# EAGLE design PRECISION_CLOCK (1) (EAGLE 9.6.2)
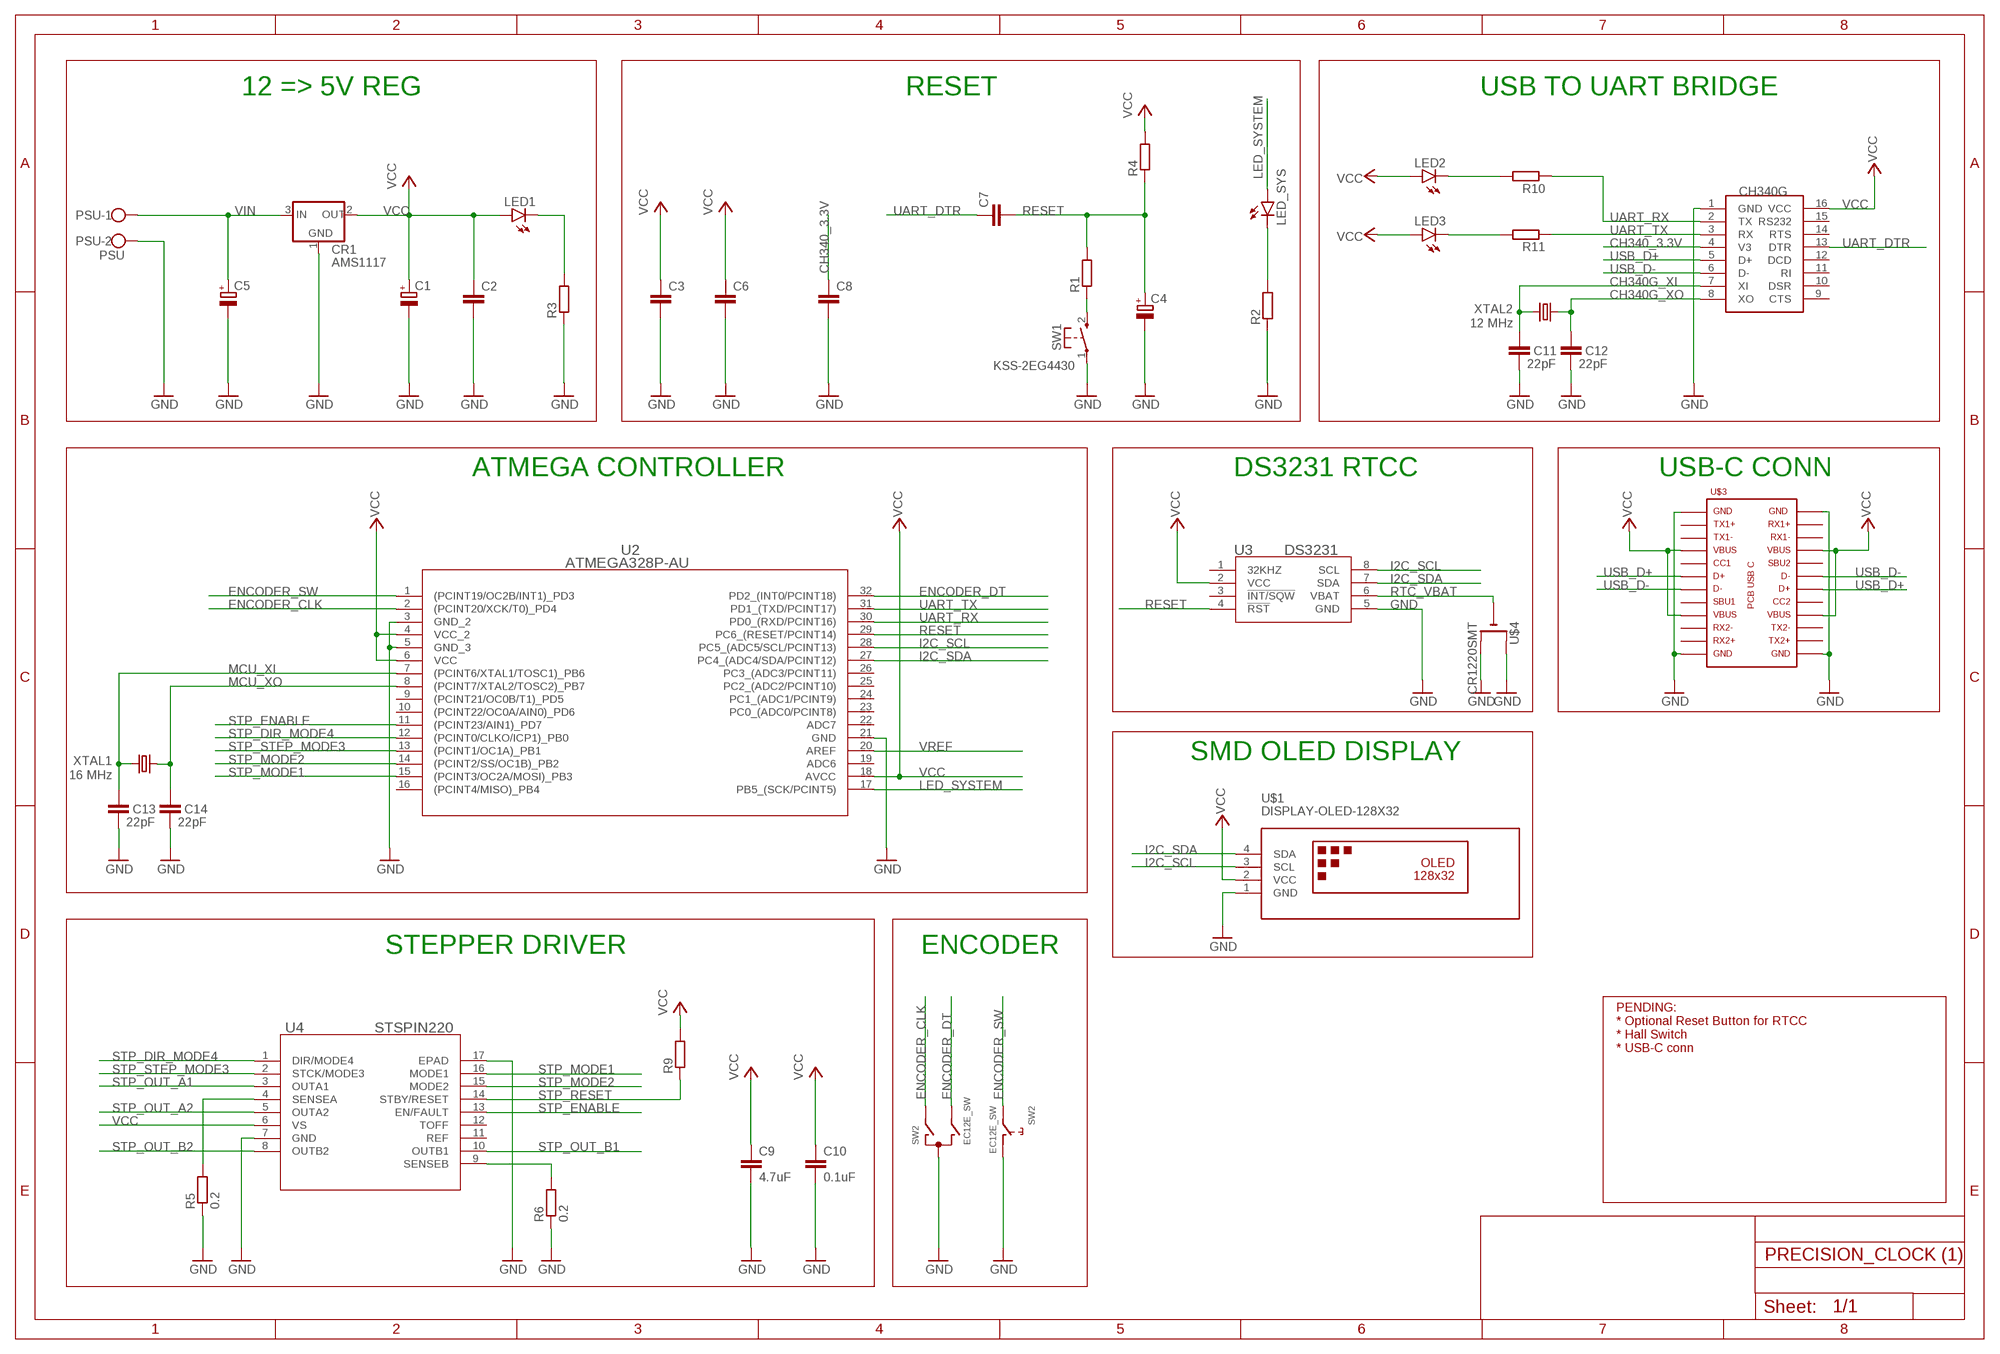
[diagram p0: schematic, sheet 1]

## Parts
C1  CPOL-EU153CLV-0505  [153CLV-0505]
C2  C-EUC0805  [C0805]
C3  C-EUC0805  [C0805]
C4  CPOL-EU153CLV-0505  [153CLV-0505]
C5  CPOL-EU153CLV-0505  [153CLV-0505]
C6  C-EUC0805  [C0805]
C7  C-EUC0805  [C0805]
C8  C-EUC0805  [C0805]
C9  4.7uF  C-EUC0805  [C0805]
C10  0.1uF  C-EUC0805  [C0805]
C11  22pF  C-EUC0805  [C0805]
C12  22pF  C-EUC0805  [C0805]
C13  22pF  C-EUC0805  [C0805]
C14  22pF  C-EUC0805  [C0805]
CR1  AMS1117  [SOT223]
LED1  LEDSML0805  [SML0805]
LED2  LEDSML0805  [SML0805]
LED3  LEDSML0805  [SML0805]
LED_SYS  LEDSML0805  [SML0805]
PSU  PSU  W237-102  [W237-102]
R1  R-EU_R0805  [R0805]
R2  R-EU_R0805  [R0805]
R3  R-EU_R0805  [R0805]
R4  R-EU_R0805  [R0805]
R5  0.2  R-EU_R0805  [R0805]
R6  0.2  R-EU_R0805  [R0805]
R9  R-EU_R0805  [R0805]
R10  R-EU_R0805  [R0805]
R11  R-EU_R0805  [R0805]
SW1  KSS-2EG4430  [KSS-2EG4430]
SW2  EC12E_SW  [ALPS_EC12E_SW]
U2  ATMEGA328P-AU  [32A_ATM]
U3  DS3231  [21-0041B_8_MXM]
U4  STSPIN220  [VFQFPN-16_STM]
U$1  DISPLAY-OLED-128X32  [DISPLAY-OLED-128X32]
U$2  CH340G  [SOIC16]
U$3  PCB_USB_CDS_2  [USB_TYPE_C_DS_2]
U$4  CR1220SMT  [CR1220-SMD]
XTAL1  16 MHz  CRYSTALSM49  [SM49]
XTAL2  12 MHz  CRYSTALSM49  [SM49]

## Nets
CH340_3.3V: C8.1 U$2.4(V3)
CH340G_XI: C11.1 U$2.7(XI) XTAL2.2
CH340G_XO: C12.1 U$2.8(XO) XTAL2.1
ENCODER_CLK: SW2.A U2.2((PCINT20/XCK/T0)_PD4)
ENCODER_DT: SW2.B U2.32(PD2_(INT0/PCINT18))
ENCODER_SW: SW2.E U2.1((PCINT19/OC2B/INT1)_PD3)
GND: C1.- C2.2 C3.2 C4.- C5.- C6.2 C8.2 C9.2 C10.2 C11.2 C12.2 C13.2 C14.2 CR1.1(GROUND) PSU.2 R2.1 R3.1 R5.1 R6.1 SW1.1(P) SW2.C SW2.D U2.3(GND_2) U2.5(GND_3) U2.21(GND) U3.5(GND) U4.7(GND) U4.17(EPAD) U$1.1(GND) U$2.1(GND) U$3.A1 U$3.A12 U$3.B1 U$3.B12 U$4.+$1(+) U$4.+$2(+1)
I2C_SCL: U2.28(PC5_(ADC5/SCL/PCINT13)) U3.8(SCL) U$1.3(SCL)
I2C_SDA: U2.27(PC4_(ADC4/SDA/PCINT12)) U3.7(SDA) U$1.4(SDA)
LED_SYSTEM: LED_SYS.A U2.17(PB5_(SCK/PCINT5))
MCU_XI: C13.1 U2.7((PCINT6/XTAL1/TOSC1)_PB6) XTAL1.2
MCU_XO: C14.1 U2.8((PCINT7/XTAL2/TOSC2)_PB7) XTAL1.1
N$1: LED_SYS.C R2.2
N$2: R5.2 U4.4(SENSEA)
N$3: LED1.C R3.2
N$4: R1.1 SW1.2(S)
N$5: R6.2 U4.9(SENSEB)
N$10: LED2.C R10.2
N$11: LED3.C R11.2
RESET: C4.+ C7.2 R1.2 R4.1 U2.29(PC6_(RESET/PCINT14)) U3.4(!RST)
RTC_VBAT: U3.6(VBAT) U$4.-
STP_DIR_MODE4: U2.12((PCINT0/CLKO/ICP1)_PB0) U4.1(DIR/MODE4)
STP_ENABLE: U2.11((PCINT23/AIN1)_PD7) U4.13(EN/FAULT)
STP_MODE1: U2.15((PCINT3/OC2A/MOSI)_PB3) U4.16(MODE1)
STP_MODE2: U2.14((PCINT2/SS/OC1B)_PB2) U4.15(MODE2)
STP_OUT_A1: U4.3(OUTA1)
STP_OUT_A2: U4.5(OUTA2)
STP_OUT_B1: U4.10(OUTB1)
STP_OUT_B2: U4.8(OUTB2)
STP_RESET: R9.1 U4.14(STBY/RESET)
STP_STEP_MODE3: U2.13((PCINT1/OC1A)_PB1) U4.2(STCK/MODE3)
UART_DTR: C7.1 U$2.13(DTR)
UART_RX: R10.1 U2.30(PD0_(RXD/PCINT16)) U$2.2(TX)
UART_TX: R11.1 U2.31(PD1_(TXD/PCINT17)) U$2.3(RX)
USB_D+: U$2.5(D+) U$3.A6 U$3.B6
USB_D-: U$2.6(D-) U$3.A7 U$3.B7
VCC: C1.+ C2.1 C3.1 C6.1 C9.1 C10.1 CR1.2(OUT) LED1.A LED2.A LED3.A R4.2 R9.2 U2.4(VCC_2) U2.6(VCC) U2.18(AVCC) U3.2(VCC) U4.6(VS) U$1.2(VCC) U$2.16(VCC) U$3.A4 U$3.A9 U$3.B4 U$3.B9
VIN: C5.+ CR1.3(IN) PSU.1
VREF: U2.20(AREF)
Unconnected: SW2.GND1(G) SW2.GND2(G) U2.9((PCINT21/OC0B/T1)_PD5) U2.10((PCINT22/OC0A/AIN0)_PD6) U2.16((PCINT4/MISO)_PB4) U2.19(ADC6) U2.22(ADC7) U2.23(PC0_(ADC0/PCINT8)) U2.24(PC1_(ADC1/PCINT9)) U2.25(PC2_(ADC2/PCINT10)) U2.26(PC3_(ADC3/PCINT11)) U3.1(32KHZ) U3.3(!INT/SQW) U4.11(REF) U4.12(TOFF) U$2.9(CTS) U$2.10(DSR) U$2.11(RI) U$2.12(DCD) U$2.14(RTS) U$2.15(RS232) U$3.A2 U$3.A3 U$3.A5 U$3.A8 U$3.A10 U$3.A11 U$3.B2 U$3.B3 U$3.B5 U$3.B8 U$3.B10 U$3.B11

## Notes on the sheet
- 12 => 5V REG | RESET | USB TO UART BRIDGE
- ATMEGA CONTROLLER | DS3231 RTCC | USB-C CONN
- SMD OLED DISPLAY
- STEPPER DRIVER | ENCODER
- PENDING:
  * Optional Reset Button for RTCC
  * Hall Switch
  * USB-C conn

## Library data of the parts
C1 C4 C5 = resistor:CPOL-EU: POLARIZED CAPACITOR, European symbol
C2 C3 C6-C14 = resistor:C-EU: CAPACITOR, European symbol
CR1 = AMS1117:AMS1117
LED1-LED3 LED_SYS = led:LED: LED OSRAM: - CHIPLED LG R971, LG N971, LY N971, LG Q971, LY Q971, LO R971, LY R971 LH N974, LH R974 LS Q976, LO Q976, LY Q976 LO Q996 - Hyper CHIPLED LW Q18S LB Q993, LB Q99A, LB R99A - SideLED LS A670, LO A670, LY A670, LG A670, LP A670 LB A673, LV A673, LT A673, LW A673 LH A674 LY A675 LS A676, LA A676, LO A676, LY A676, LW A676 LS A679, LY A679, LG A679 - Hyper Micro SIDELED® LS Y876, LA Y876, LO Y876, LY Y876 LT Y87S - SmartLED LW L88C, LW L88S LB L89C, LB L89S, LG L890 LS L89K, LO L89K, LY L89K LS L896, LA L896, LO L896, LY L896 - TOPLED LS T670, LO T670, LY T670, LG T670, LP T670 LSG T670, LSP T670, LSY T670, LOP T670, LYG T670 LG T671, LOG T671, LSG T671 LB T673, LV T673, LT T673, LW T673 LH T674 LS T676, LA T676, LO T676, LY T676, LB T676, LH T676, LSB T676, LW T676 LB T67C, LV T67C, LT T67C, LS T67K, LO T67K, LY T67K, LW E67C LS E67B, LA E67B, LO E67B, LY E67B, LB E67C, LV E67C, LT E67C LW T67C LS T679, LY T679, LG T679 LS T770, LO T770, LY T770, LG T770, LP T770 LB T773, LV T773, LT T773, LW T773 LH T774 LS E675, LA E675, LY E675, LS T675 LS T776, LA T776, LO T776, LY T776, LB T776 LHGB T686 LT T68C, LB T68C - Hyper Mini TOPLED® LB M676 - Mini TOPLED Santana® LG M470 LS M47K, LO M47K, LY M47K Source: http://www.osram.convergy.de LUXEON: - LUMILED® LXK2-PW12-R00, LXK2-PW12-S00, LXK2-PW14-U00, LXK2-PW14-V00 LXK2-PM12-R00, LXK2-PM12-S00, LXK2-PM14-U00 LXK2-PE12-Q00, LXK2-PE12-R00, LXK2-PE12-S00, LXK2-PE14-T00, LXK2-PE14-U00 LXK2-PB12-K00, LXK2-PB12-L00, LXK2-PB12-M00, LXK2-PB14-N00, LXK2-PB14-P00, LXK2-PB14-Q00 LXK2-PR12-L00, LXK2-PR12-M00, LXK2-PR14-Q00, LXK2-PR14-R00 LXK2-PD12-Q00, LXK2-PD12-R00, LXK2-PD12-S00 LXK2-PH12-R00, LXK2-PH12-S00 LXK2-PL12-P00, LXK2-PL12-Q00, LXK2-PL12-R00 Source: www.luxeon.com KINGBRIGHT: KA-3528ASYC Source: www.kingbright.com
PSU = con-wago-500:W237-102: WAGO SCREW CLAMP; MPN: 237-102; OC_FARNELL: unknown; OC_NEWARK: 70K9898
R1-R6 R9-R11 = resistor:R-EU_: RESISTOR, European symbol
SW1 = buttons:KSS-2EG4430: Size: 3x6mm Height: 5mm from PCB Rating: DC12v 50mA Travel: 0.25±0.10mm Operating Force: 180±50gf Return Force: 60gf min Contact resistance: 100m? max Insulation resistance: 100M? min Operating life?50,000 cycles
SW2 = switch-alps:EC12E_SW: ALPS rotary Encoder EC12E series with switch; MPN: EC12E2424407; OC_FARNELL: 1520813; OC_NEWARK: 74M1068
U2 = Atmega328P:ATMEGA328P-AU; BUILT_BY: EMA_UL_Team; MANUFACTURER_PART_NUMBER: ATMEGA328P-AU; SOURCELIBRARY: Atmel_2011-04-02; VENDOR: Atmel
U3 = DS3231:DS3231; BUILT_BY: EMA_UL_Team; MANUFACTURER_PART_NUMBER: DS3231MZ/V+T; REVISION: 3; SOURCELIBRARY: Maxim_2014-04-30_1; VENDOR: Maxim Integrated Products
U4 = STSPIN220:STSPIN220; BUILT_BY: EMA_Jessica; COPYRIGHT: Copyright (C) 2018 Accelerated Designs. All rights reserved; MANUFACTURER_PART_NUMBER: STSPIN220; SOURCELIBRARY: Update_to_database_2020-12-04; VENDOR: STMicroelectronics
U$1 = diy-modules:DISPLAY-OLED-128X32: 128x32 Dot Matrix OLED Module with I2C interface based on SSD1306 chip More details available here: http://www.tinyosshop.com/index.php?route=product/product&product_id=953 Schematic available here: http://www.tinyosshop.com/datasheet/OLED%2012832.pdf SSD1306 datasheet: https://cdn-shop.adafruit.com/datasheets/SSD1306.pdf Click here to find device on ebay.com <http://www.ebay.com/sch/oled+display+128x32+i2c>
U$2 = ch340g:CH340G
U$3 = USB_pcb_connectors:PCB_USB_C
U$4 = CR1220:CR1220: CR1216/CR1220/CR1225 12mm 3V lithium coin cell Great for battery packup. Both SMT and THM holders. Note the THM package has the ground pads on both sides of the PCB so that the masks are the same - this reduces the cost Check prices <https://pricing.snapeda.com/parts/CR1220/FDK%20America%2C%20Inc.%2C%20a%20member%20of%20Fujitsu%20Group/view-part?ref=eda>; AVAILABILITY: In Stock; DESCRIPTION: Coin, 12.5mm Lithium Manganese Dioxide 3V Battery Non-Rechargeable (Primary); MF: FDK America, Inc., a member of Fujitsu Group; MP: CR1220; PACKAGE: FDK America, Inc., a member of Fujitsu Group; PRICE: None
XTAL1 XTAL2 = crystal:CRYSTAL: CRYSTAL; OC_FARNELL: unknown; OC_NEWARK: unknown

## Board
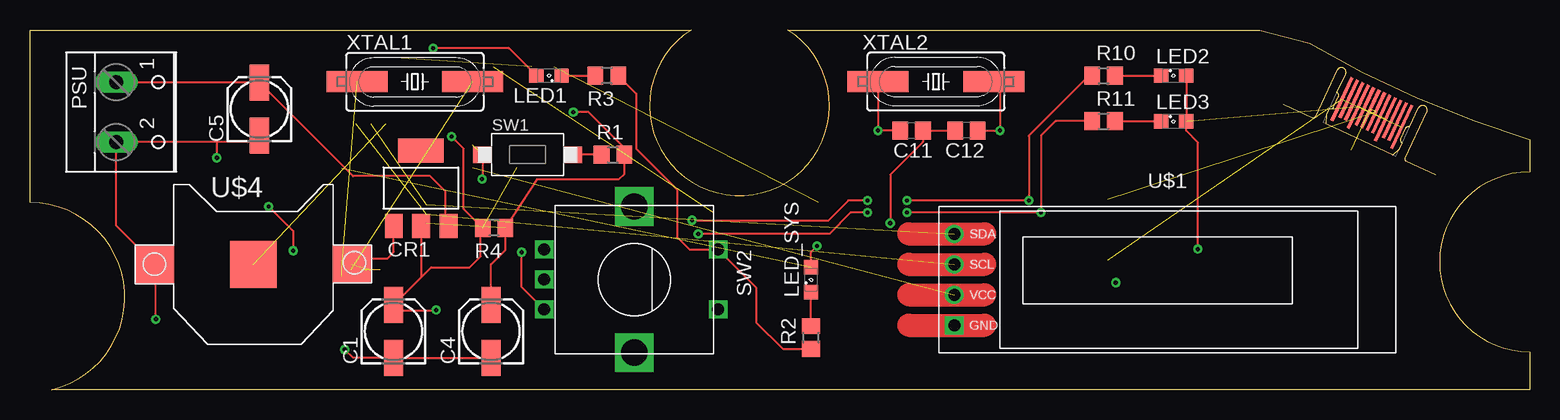
[diagram p1: board, top side]
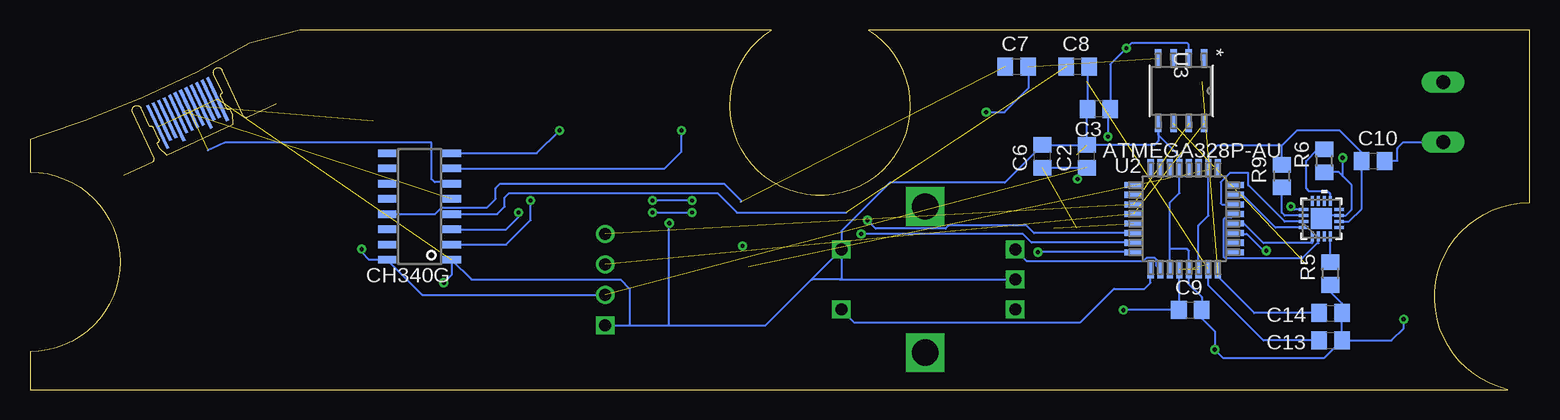
[diagram p2: board, bottom side, seen from below]

Size 125 x 30 mm. Coordinates in mm from the lower left corner, seen from the top.
Outline: 125,0 1.8,0 arc167 0,15.6 0,30 55.1,30 arc295 63.18,30 102.52,30 106.67,28.89 arc13 125,20.85 125,18.15 arc180 125,3.15 125,0
Copper layers (1*16): Top 0.035mm / dielectric 1.5mm / Bottom 0.035mm
Design rules "default": minimum track width 6mil, minimum drill 0.35mm, track to track 6mil, track to pad 6mil, pad to pad 6mil, via to via 6mil, smd to smd 6mil, copper to edge 40mil, drill to drill 6mil, minimum pad ring 10mil, minimum via ring 8mil, stop-mask expansion 4mil, vias tented up to drill 0mil, thermal gap 10mil

### Footprints (pad centres in the part's own frame; a part is rotated, then mirrored left to right if it is on the bottom)
153CLV-0505 = smd 3 x 1.6: + 2.2,0; - -2.2,0
C0805 = smd 1.3 x 1.5: 1 -0.95,0; 2 0.95,0
SOT223 = smd 1.499 x 2.007: 1 -2.261,-3.15; 2 0.025,-3.15; 3 2.311,-3.15 | smd 3.81 x 2.007: 4 0,3.15
SML0805 = smd 1.2 x 1.2: A 1.05,0; C -1.05,0
W237-102 = drill 1.194 long: 1 -2.5,-1.27; 2 2.5,-1.27
R0805 = smd 1.3 x 1.5: 1 -0.95,0; 2 0.95,0
KSS-2EG4430 = smd 1.6 x 1.4: 1 -3.75,0; 2 3.75,0
ALPS_EC12E_SW = drill 1 square: A -2.5,-7.5; B 2.5,-7.5; C 0,-7.5; D -2.5,7; E 2.5,7 | drill 2.2 square: GND1 -6.1,0; GND2 6.1,0
32A_ATM = smd 1.473 x 0.508: 1 -4.242,2.8; 2 -4.242,2; 3 -4.242,1.2; 4 -4.242,0.4; 5 -4.242,-0.4; 6 -4.242,-1.2; 7 -4.242,-2; 8 -4.242,-2.8; 17 4.242,-2.8; 18 4.242,-2; 19 4.242,-1.2; 20 4.242,-0.4; 21 4.242,0.4; 22 4.242,1.2; 23 4.242,2; 24 4.242,2.8 | smd 0.508 x 1.473: 9 -2.8,-4.242; 10 -2,-4.242; 11 -1.2,-4.242; 12 -0.4,-4.242; 13 0.4,-4.242; 14 1.2,-4.242; 15 2,-4.242; 16 2.8,-4.242; 25 2.8,4.242; 26 2,4.242; 27 1.2,4.242; 28 0.4,4.242; 29 -0.4,4.242; 30 -1.2,4.242; 31 -2,4.242; 32 -2.8,4.242
21-0041B_8_MXM = smd 1.46 x 0.533: 1 -2.724,1.905; 2 -2.724,0.635; 3 -2.724,-0.635; 4 -2.724,-1.905; 5 2.724,-1.905; 6 2.724,-0.635; 7 2.724,0.635; 8 2.724,1.905
VFQFPN-16_STM = smd 0.813 x 0.254: 1 -1.473,0.75; 2 -1.473,0.25; 3 -1.473,-0.25; 4 -1.473,-0.75; 9 1.473,-0.75; 10 1.473,-0.25; 11 1.473,0.25; 12 1.473,0.75 | smd 0.254 x 0.813: 5 -0.75,-1.473; 6 -0.25,-1.473; 7 0.25,-1.473; 8 0.75,-1.473; 13 0.75,1.473; 14 0.25,1.473; 15 -0.25,1.473; 16 -0.75,1.473 | smd 1.753 x 1.753: 17 0,0
DISPLAY-OLED-128X32 = drill 1 square: 1 -17.78,-3.81 | drill 1: 2 -17.78,-1.27; 3 -17.78,1.27; 4 -17.78,3.81
SOIC16 = smd 0.635 x 1.524: 1 -4.445,-2.695; 2 -3.175,-2.695; 3 -1.905,-2.695; 4 -0.635,-2.695; 5 0.635,-2.695; 6 1.905,-2.695; 7 3.175,-2.695; 8 4.445,-2.695; 9 4.445,2.695; 10 3.175,2.695; 11 1.905,2.695; 12 0.635,2.695; 13 -0.635,2.695; 14 -1.905,2.695; 15 -3.175,2.695; 16 -4.445,2.695
USB_TYPE_C_DS_2 = smd 0.25 x 4: A1 2.75,-2.45; A4 1.25,-2.45; A9 -1.25,-2.45; A12 -2.75,-2.45 | smd 0.25 x 3.5: A2 2.25,-2.7; A3 1.75,-2.7; A5 0.75,-2.7; A6 0.25,-2.7; A7 -0.25,-2.7; A8 -0.75,-2.7; A10 -1.75,-2.7; A11 -2.25,-2.7 | smd 0.25 x 4 bottom: B1 -2.75,-2.45; B4 -1.25,-2.45; B9 1.25,-2.45; B12 2.75,-2.45 | smd 0.25 x 3.5 bottom: B2 -2.25,-2.7; B3 -1.75,-2.7; B5 -0.75,-2.7; B6 -0.25,-2.7; B7 0.25,-2.7; B8 0.75,-2.7; B10 1.75,-2.7; B11 2.25,-2.7
CR1220-SMD = smd 3.2 x 3.2: +$1 -8.2,0; +$2 8.2,0 | smd 3.9 x 3.9: - 0,0
SM49 = smd 5.08 x 1.778: 1 -4.826,0; 2 4.826,0

### Placement (x,y rotation side)
C1  30.31,4.85 90 top
C2  36.91,19.46 90 bottom
C3  35.9,23.4 180 bottom
C4  38.44,4.85 90 top
C5  19.13,23.4 90 top
C6  40.59,19.46 90 bottom
C7  42.75,26.95 0 bottom
C8  37.67,26.95 0 bottom
C9  28.28,6.63 0 bottom
C10  13.04,19.08 0 bottom
C11  73.49,21.62 0 top
C12  78.06,21.62 180 top
C13  16.59,4.09 0 bottom
C14  16.59,6.38 0 bottom
CR1  32.59,16.79 0 top
LED1  43.26,26.19 180 top
LED2  95.33,26.19 0 top
LED3  95.33,22.38 0 top
LED_SYS  65.11,9.17 90 top
PSU  8.46,23.14 270 top
R1  48.6,19.59 0 top
R2  65.11,4.35 90 top
R3  48.09,26.19 180 top
R4  38.69,13.49 180 top
R5  16.59,9.68 90 bottom
R6  17.1,19.08 90 bottom
R9  20.66,17.81 90 bottom
R10  89.49,26.19 0 top
R11  89.49,22.38 0 top
SW1  41.48,19.59 0 top
SW2  50.37,9.17 270 top
U2  28.78,14.25 90 bottom
U3  29.04,24.92 270 bottom
U4  17.35,14.25 90 bottom
U$1  94.82,9.17 0 top
U$2  92.54,15.27 90 bottom
U$3  110.83,20.86 155 top
U$4  18.62,10.44 0 top
XTAL1  32.09,25.68 0 top
XTAL2  75.52,25.68 180 top

### Tracks (layer width: path | path; a pad name or v marks a point on that pad's centre or on a via)
CH340_3.3V  (1 unrouted)
  Bottom 0.152: U$2.4 86.06,14.63 85.43,15.27 85.43,16.03 85.07,16.38 67.7,16.38 66.07,14.76 56.98,14.76
CH340G_XI  (via drill 0.35)
  Top 0.152: XTAL2.2 v70.69,21.62 C11.1
  Bottom 0.152: U$2.7 72.09,18.44 70.69,19.84 v70.69,21.62
CH340G_XO  (via drill 0.35)
  Top 0.152: XTAL2.1 80.85,25.17 v80.85,21.62 C12.1
  Bottom 0.152: U$2.8 82.76,19.71 v80.85,21.62
ENCODER_CLK
  Bottom 0.152: U2.2 31.1,10.33 31.1,10.84 31.23,10.98 31.93,10.98 32.21,10.7 41.9,10.7 SW2.A
ENCODER_DT  (via drill 0.35)
  Top 0.152: SW2.B 40.98,8.57 v40.98,11.46
  Bottom 0.152: U2.32 v40.98,11.46
ENCODER_SW
  Bottom 0.152: SW2.E 56.32,5.62 37.42,5.62 34.63,8.41 32.09,8.41 31.58,8.91 U2.1
GND  (via drill 0.35)  (6 unrouted)
  Top 0.152: U$4.+$2 27.33,10.95 29.8,10.95 30.33,11.48 CR1.1 | C4.- C1.- 26.92,2.65 v26.24,3.33 | C5.- 18.58,20.64 15.58,20.64 | 15.58,20.64 PSU.2 7.19,13.67 U$4.+$1 10.42,5.94 v10.5,5.87 | R3.1 50.53,24.69 50.53,20.09 53.93,16.7 53.93,12.73 54.99,11.67 SW2.D 60.53,8.51 60.53,5.62 62.75,3.4 R2.1 | 37.17,19.02 SW1.1 37.73,17.61 v37.67,17.55 | 15.58,20.64 v15.58,19.33 | C12.2 C11.2 74.44,20.66 71.71,17.94 v71.71,13.87
  Bottom 0.152: 29.98,11.71 U2.3 30.05,9.94 | 29.98,11.71 29.98,15.59 29.18,16.39 U2.21 29.18,19.48 30.94,21.24 U3.5 30.94,20.73 31.26,20.41 C2.2 | C10.2 12.05,19.11 12.02,19.08 11,19.08 11,20.09 11.04,20.13 10.52,20.64 PSU.2 | 15.52,14.5 U4.7 | U4.7 15.33,14.5 14.81,15.01 14.81,17.05 15.58,17.81 | 15.58,17.81 15.9,18.13 R6.1 | C2.2 36.91,23.33 C3.2 36.85,26.83 C8.2 | C2.2 C6.2 43.74,17.27 53.33,17.27 57.37,13.22 SW2.D | C13.2 15.58,4.09 | 29.98,11.71 28.53,11.71 28.38,11.57 U2.5 28.38,8.77 27.33,7.71 C9.2 27.33,5.94 26.24,4.85 v26.24,3.33 25.52,2.61 17.13,2.61 C13.2 | 57.49,9.17 SW2.C | U$1.1 75.01,5.36 | 75.01,5.36 71.71,5.36 | 71.71,5.36 63.68,5.36 59.82,9.22 | 59.82,9.22 SW2.D | 75.01,5.36 75.01,8.41 75.77,9.17 88.19,9.17 U$2.1 89.84,9.58 v90.51,8.92 | 15.58,17.81 v15.58,19.33 | 57.49,9.17 59.77,9.17 59.82,9.22 | SW2.D 57.37,9.28 57.49,9.17 | C13.2 C14.2 15.64,7.21 16.59,8.16 R5.1 | U4.7 17.1,14.5 U4.17 | C13.2 11.51,4.09 10.5,5.11 v10.5,5.87 | 71.71,5.36 v71.71,13.87
I2C_SCL  (2 unrouted)
I2C_SDA  (2 unrouted)
LED_SYSTEM  (via drill 0.35)  (1 unrouted)
  Top 0.152: LED_SYS.A 65.11,11.46 v65.61,11.97
MCU_XI  (1 unrouted)
  Bottom 0.152: C13.1 22.18,4.09 26.78,8.7 U2.7
MCU_XO  (2 unrouted)
  Bottom 0.152: C14.1 22.94,6.38 25.99,9.43
N$1
  Top 0.152: R2.2 LED_SYS.C
N$2
  Bottom 0.152: R5.2 16.59,12.77 U4.4
N$3
  Top 0.152: LED1.C R3.2
N$4
  Top 0.152: R1.1 SW1.2
N$5
  Bottom 0.152: U4.9 16.6,16.3 16.85,16.54 18.37,16.54 18.62,16.79 18.62,19.08 17.67,20.03 R6.2
N$10
  Top 0.152: R10.2 LED2.C
N$11
  Top 0.152: R11.2 LED3.C
RESET  (via drill 0.35)  (2 unrouted)
  Top 0.152: C4.+ 38.44,10.44 39.64,11.65 R4.1 42.31,17.55 49.1,17.55 49.55,18 R1.2 49.55,20.16 46.56,23.14 v45.29,23.14
  Bottom 0.152: v45.29,23.14 43.77,23.14 41.74,25.17 41.74,26.89 C7.2
RTC_VBAT  (1 unrouted)
STP_DIR_MODE4
  Bottom 0.152: U4.1 18.12,12.77 18.12,12.22 22.18,12.22 23.81,13.85 U2.12
STP_ENABLE  (via drill 0.35)
  Top 0.152: v19.89,15.27 21.93,13.24 v21.93,11.59
  Bottom 0.152: U4.13 18.84,15.01 19.64,15.01 v19.89,15.27 | U2.11 24.47,12.98 23.58,12.98 22.18,11.59 v21.93,11.59 21.9,11.59
STP_MODE1
  Bottom 0.152: U4.16 21.18,13.5 23.96,16.28 24.51,16.28 U2.15
STP_MODE2
  Bottom 0.152: U4.15 20.41,14 23.45,17.05 23.45,18.06 24.97,18.06 25.74,17.3 25.74,15.52 25.67,15.45 U2.14
STP_RESET
  Bottom 0.152: U4.14 20.4,14.51 20.66,14.76 R9.1
STP_STEP_MODE3
  Bottom 0.152: U2.13 24.86,14.34 25.37,14.34 25.51,14.2 25.51,11.1 25.37,10.97 18.94,10.97 17.68,12.22 17.61,12.22 17.6,12.22 U4.2
UART_DTR  (1 unrouted)
  Bottom 0.152: U$2.13 91.25,14.63 90.7,15.18 86.91,15.18 86.19,15.9 86.19,16.79 85.81,17.17 67.14,17.17 65.74,15.78 65.74,15.65
UART_RX  (via drill 0.35)
  Top 0.152: R10.1 88.29,26.19 83.27,21.17 v83.27,15.78 v73.11,15.78 | v55.2,14.13 55.25,14.07 66.51,14.07 68.22,15.78 v69.8,15.78
  Bottom 0.152: U$2.2 85.3,12.09 83.27,14.13 v83.27,15.78 | U2.30 41.3,13.05 41.93,13.68 48.43,13.68 48.67,13.44 54.51,13.44 v55.2,14.13 | v69.8,15.78 v73.11,15.78
UART_TX  (via drill 0.35)
  Top 0.152: R11.1 85.49,22.38 84.28,21.17 v84.28,14.76 v73.11,14.76 | v55.71,12.98 66.63,12.98 68.41,14.76 v69.8,14.76
  Bottom 0.152: U$2.3 85.3,13.36 84.28,14.38 v84.28,14.76 | U2.31 41.52,12.25 42.25,12.98 v55.71,12.98 | v73.11,14.76 v69.8,14.76
USB_D+  (2 unrouted)
USB_D-  (2 unrouted)
  Bottom 0.152: U$2.6 89.97,17.3 91.27,17.3 91.52,17.55 91.52,20.6 108.79,20.6 109.84,20.11 110.16,19.96
VCC  (via drill 0.35)  (7 unrouted)
  Top 0.152: LED2.A LED3.A 96.38,21.58 97.36,20.6 v97.36,11.71 | 32.62,9.37 C1.+ 30.82,6.55 33.78,6.55 v33.86,6.63 | 32.62,9.37 33.44,10.19 36.66,10.19 37.58,11.11 37.58,13.33 R4.2 36.15,15.08 36.15,20.09 v35.13,21.11 | CR1.2 32.62,9.37 | LED1.A 39.93,28.48 v33.61,28.48
  Bottom 0.152: U3.2 28.4,28.78 28.53,28.91 33.18,28.91 v33.61,28.48 34.95,27.14 C3.1 35.13,23.21 v35.13,21.11 | U2.6 27.58,13.67 26.75,14.51 26.75,18.46 U2.18 26.78,19.59 26.02,20.35 20.66,20.35 | U2.4 29.23,9.97 C9.1 v33.86,6.63 | U4.6 15.06,14 13.99,15.08 C10.1 13.99,19.77 15.83,21.62 19.39,21.62 20.66,20.35 | C6.1 C2.1 | R9.2 20.66,20.35 | U$1.2 92.31,7.9 U$2.16 96.73,10.82 97.36,11.46 v97.36,11.71
VIN
  Top 0.152: PSU.1 7.24,25.6 C5.+ 26.92,17.81 33.36,17.81 34.63,16.54 34.63,13.92 CR1.3